# Altium schematic sheet tabdil motor.SchDoc
size A
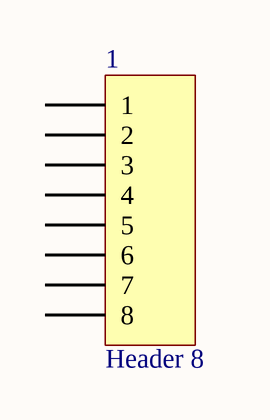
[diagram p0: tabdil motor.SchDoc]

## Parts
1  Header 8  [tabdil motor]

## Nets

Not connected (* = marked no-connect by the designer): 1 1 2 3 4 5 6 7 8

## Library data of the parts
1 = Header 8: Header, 8-Pin; LatestRevisionDate: 17-Jul-2002; LatestRevisionNote: Re-released for DXP Platform.; Publisher: Altium Limited